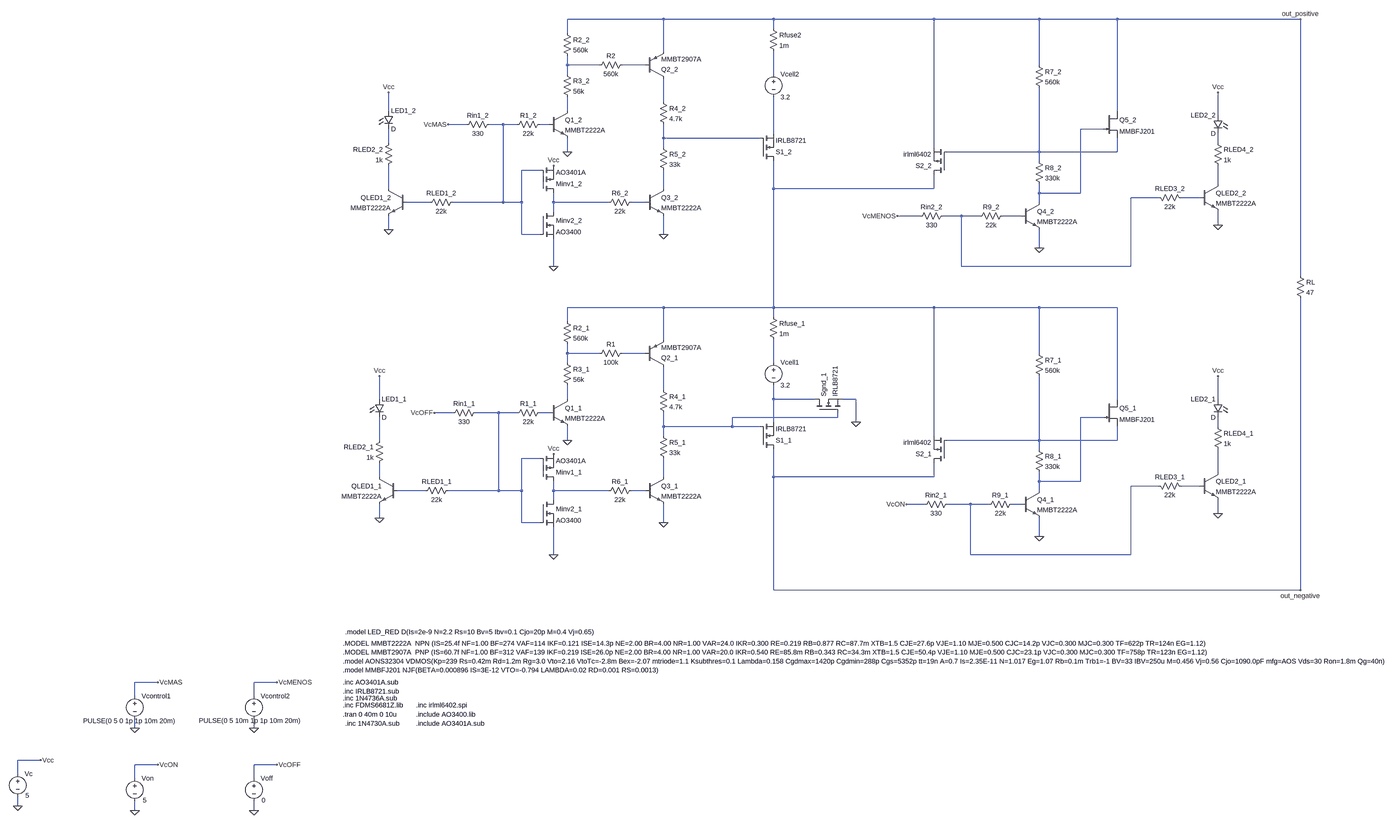
[diagram p0: schematic prueba de resistencias.asc, whole sheet]
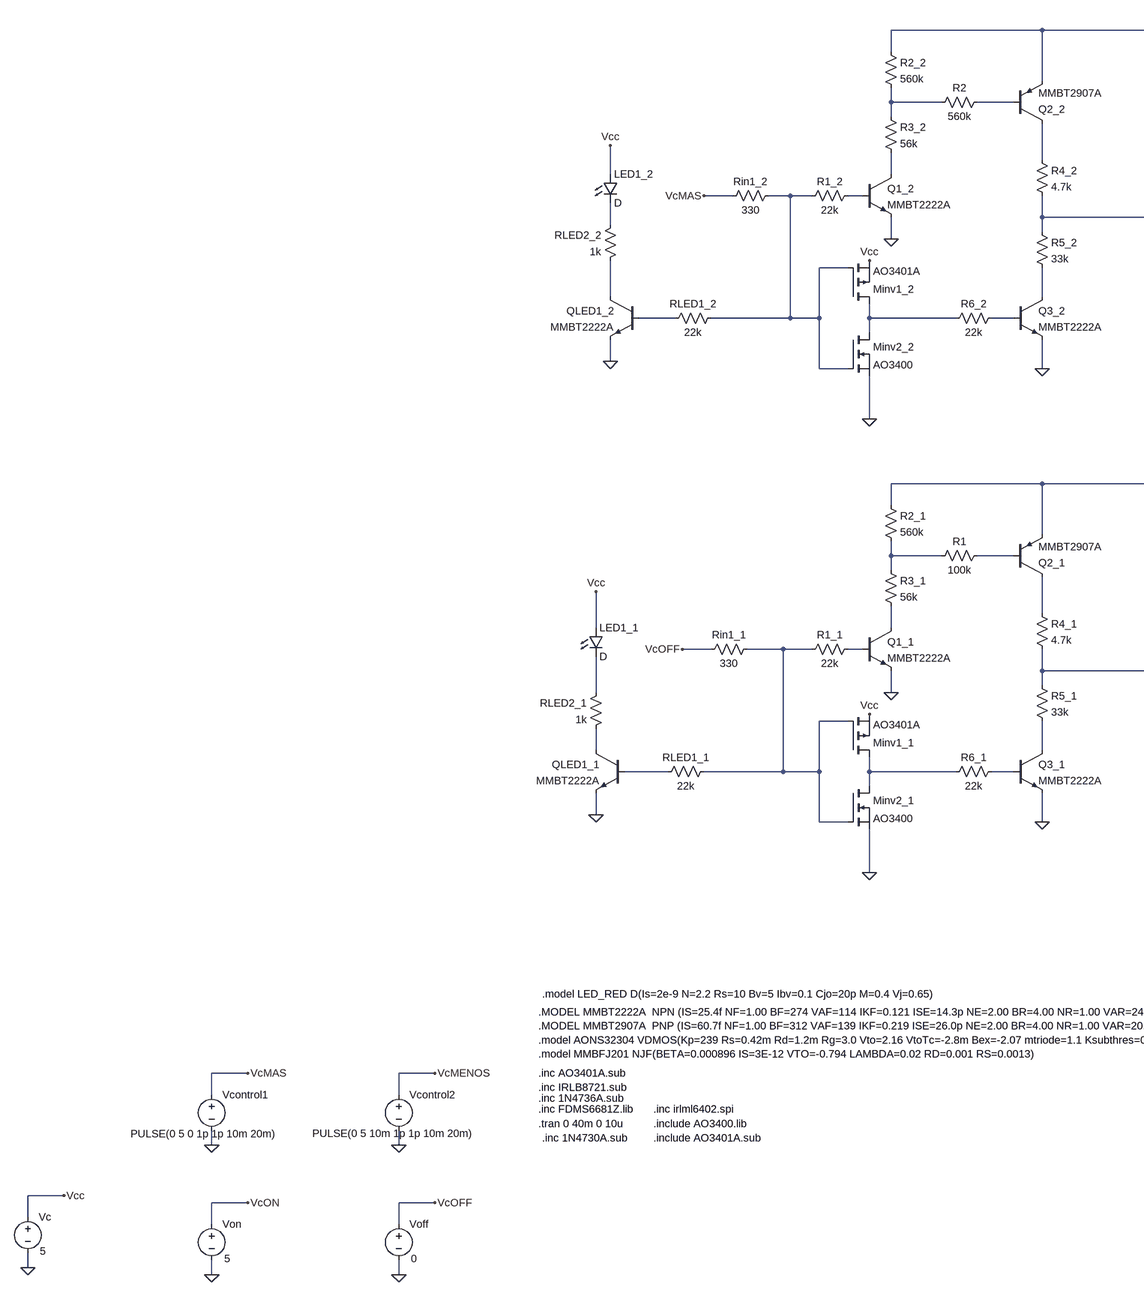
[diagram p1: schematic prueba de resistencias.asc, part, row 1 of 1, column 1 of 2]
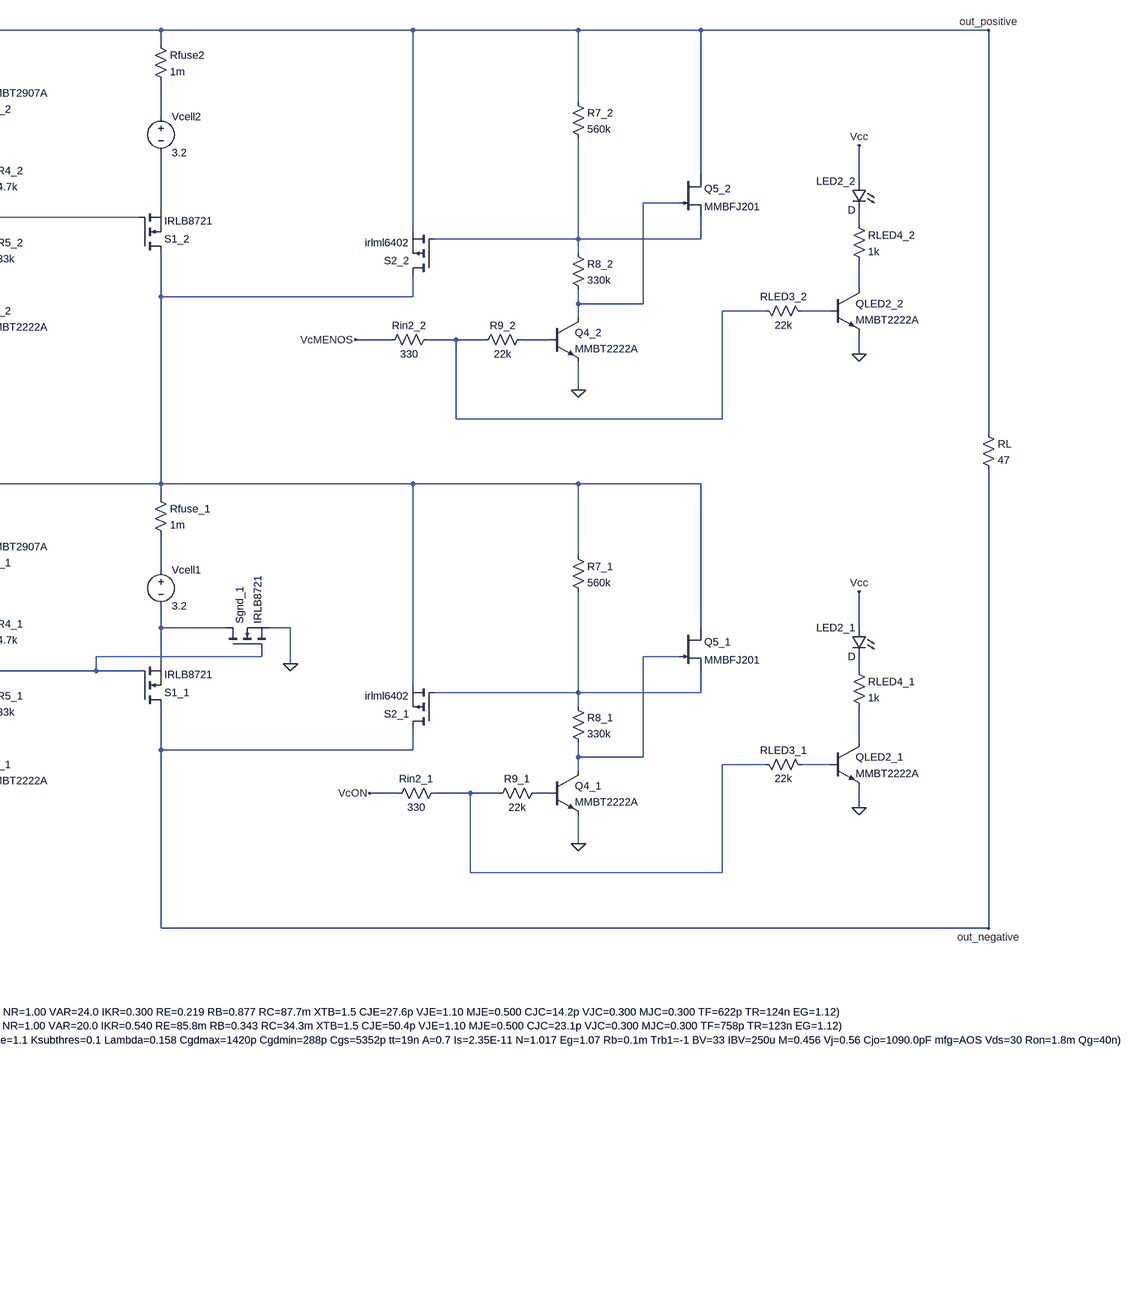
[diagram p2: schematic prueba de resistencias.asc, part, row 1 of 1, column 2 of 2]
prueba de resistencias.asc, the LTspice schematic file:
Version 4.1
SHEET 1 7672 2128
WIRE 896 -1696 560 -1696
WIRE 1280 -1696 896 -1696
WIRE 1840 -1696 1280 -1696
WIRE 2208 -1696 1840 -1696
WIRE 2480 -1696 2208 -1696
WIRE 3120 -1696 2480 -1696
WIRE 1280 -1664 1280 -1696
WIRE 560 -1648 560 -1696
WIRE 896 -1584 896 -1696
WIRE 560 -1536 560 -1568
WIRE 672 -1536 560 -1536
WIRE 832 -1536 752 -1536
WIRE 2208 -1536 2208 -1696
WIRE 560 -1504 560 -1536
WIRE 1280 -1504 1280 -1584
WIRE 896 -1408 896 -1488
WIRE -64 -1376 -64 -1440
WIRE 560 -1376 560 -1424
WIRE 2480 -1376 2480 -1696
WIRE 2832 -1360 2832 -1440
WIRE 208 -1328 144 -1328
WIRE 336 -1328 288 -1328
WIRE 384 -1328 336 -1328
WIRE 496 -1328 464 -1328
WIRE 2432 -1312 2352 -1312
WIRE 1280 -1296 1280 -1424
WIRE 896 -1280 896 -1328
WIRE 1232 -1280 896 -1280
WIRE -64 -1264 -64 -1312
WIRE 2832 -1264 2832 -1296
WIRE 896 -1248 896 -1280
WIRE 1840 -1248 1840 -1696
WIRE 560 -1232 560 -1280
WIRE 2208 -1232 2208 -1456
WIRE 2208 -1232 1888 -1232
WIRE 2480 -1232 2480 -1280
WIRE 2480 -1232 2208 -1232
WIRE 2208 -1200 2208 -1232
WIRE 464 -1168 400 -1168
WIRE 2832 -1120 2832 -1184
WIRE -64 -1104 -64 -1184
WIRE 896 -1104 896 -1168
WIRE 1280 -1104 1280 -1200
WIRE 1840 -1104 1840 -1152
WIRE 1840 -1104 1280 -1104
WIRE 2208 -1088 2208 -1120
WIRE 2352 -1088 2352 -1312
WIRE 2352 -1088 2208 -1088
WIRE 2624 -1072 2528 -1072
WIRE 2768 -1072 2704 -1072
WIRE 80 -1056 0 -1056
WIRE 336 -1056 336 -1328
WIRE 336 -1056 160 -1056
WIRE 400 -1056 400 -1168
WIRE 400 -1056 336 -1056
WIRE 512 -1056 512 -1088
WIRE 704 -1056 512 -1056
WIRE 832 -1056 784 -1056
WIRE 2208 -1056 2208 -1088
WIRE 512 -1024 512 -1056
WIRE 1792 -1008 1712 -1008
WIRE 1936 -1008 1872 -1008
WIRE 2000 -1008 1936 -1008
WIRE 2144 -1008 2080 -1008
WIRE 2832 -976 2832 -1024
WIRE -64 -960 -64 -1008
WIRE 400 -944 400 -1056
WIRE 464 -944 400 -944
WIRE 896 -944 896 -1008
WIRE 2208 -896 2208 -960
WIRE 512 -832 512 -928
WIRE 1936 -832 1936 -1008
WIRE 2528 -832 2528 -1072
WIRE 2528 -832 1936 -832
WIRE 3120 -800 3120 -1696
WIRE 896 -688 560 -688
WIRE 1280 -688 1280 -1104
WIRE 1280 -688 896 -688
WIRE 1840 -688 1280 -688
WIRE 2208 -688 1840 -688
WIRE 2480 -688 2208 -688
WIRE 1280 -656 1280 -688
WIRE 560 -640 560 -688
WIRE 896 -576 896 -688
WIRE 560 -528 560 -560
WIRE 672 -528 560 -528
WIRE 832 -528 752 -528
WIRE 2208 -528 2208 -688
WIRE 560 -496 560 -528
WIRE 1280 -496 1280 -576
WIRE 896 -400 896 -480
WIRE -96 -368 -96 -448
WIRE 560 -368 560 -416
WIRE 1280 -368 1280 -416
WIRE 1424 -368 1280 -368
WIRE 1568 -368 1520 -368
WIRE 2480 -368 2480 -688
WIRE 2832 -368 2832 -448
WIRE 160 -320 96 -320
WIRE 320 -320 240 -320
WIRE 384 -320 320 -320
WIRE 496 -320 464 -320
WIRE 1504 -304 1504 -320
WIRE 1504 -304 1136 -304
WIRE 2432 -304 2352 -304
WIRE 1280 -288 1280 -368
WIRE 1568 -288 1568 -368
WIRE 896 -272 896 -320
WIRE 1136 -272 1136 -304
WIRE 1136 -272 896 -272
WIRE 1232 -272 1136 -272
WIRE 2832 -272 2832 -304
WIRE 896 -240 896 -272
WIRE 1840 -240 1840 -688
WIRE -96 -224 -96 -304
WIRE 560 -224 560 -272
WIRE 2208 -224 2208 -448
WIRE 2208 -224 1888 -224
WIRE 2480 -224 2480 -272
WIRE 2480 -224 2208 -224
WIRE 2208 -192 2208 -224
WIRE 464 -160 400 -160
WIRE 2832 -112 2832 -192
WIRE -96 -96 -96 -144
WIRE 896 -96 896 -160
WIRE 1280 -96 1280 -192
WIRE 1840 -96 1840 -144
WIRE 1840 -96 1280 -96
WIRE 2208 -80 2208 -112
WIRE 2352 -80 2352 -304
WIRE 2352 -80 2208 -80
WIRE 2624 -64 2528 -64
WIRE 2768 -64 2704 -64
WIRE 64 -48 -32 -48
WIRE 320 -48 320 -320
WIRE 320 -48 144 -48
WIRE 400 -48 400 -160
WIRE 400 -48 320 -48
WIRE 512 -48 512 -80
WIRE 704 -48 512 -48
WIRE 832 -48 784 -48
WIRE 2208 -48 2208 -80
WIRE 512 -16 512 -48
WIRE 1808 0 1744 0
WIRE 1968 0 1888 0
WIRE 2032 0 1968 0
WIRE 2144 0 2112 0
WIRE 2832 32 2832 -16
WIRE -96 48 -96 0
WIRE 400 64 400 -48
WIRE 464 64 400 64
WIRE 896 64 896 0
WIRE 2208 112 2208 48
WIRE 512 176 512 80
WIRE 1968 176 1968 0
WIRE 2528 176 2528 -64
WIRE 2528 176 1968 176
WIRE 1280 320 1280 -96
WIRE 3120 320 3120 -720
WIRE 3120 320 1280 320
WIRE -1072 1024 -1152 1024
WIRE -656 1024 -736 1024
WIRE -1152 1072 -1152 1024
WIRE -736 1072 -736 1024
WIRE -1152 1184 -1152 1152
WIRE -736 1184 -736 1152
WIRE -1504 1296 -1584 1296
WIRE -1072 1312 -1152 1312
WIRE -656 1312 -736 1312
WIRE -1584 1344 -1584 1296
WIRE -1152 1360 -1152 1312
WIRE -736 1360 -736 1312
WIRE -1584 1456 -1584 1424
WIRE -1152 1472 -1152 1440
WIRE -736 1472 -736 1440
FLAG 560 -224 0
FLAG 896 64 0
FLAG -1152 1184 0
FLAG -736 1184 0
FLAG -1072 1024 VcMAS
FLAG -656 1024 VcMENOS
FLAG -736 1472 0
FLAG -656 1312 VcOFF
FLAG -1152 1472 0
FLAG -1072 1312 VcON
FLAG 96 -320 VcOFF
FLAG 2208 112 0
FLAG 1744 0 VcON
FLAG -96 48 0
FLAG 2832 32 0
FLAG -96 -448 Vcc
FLAG 2832 -448 Vcc
FLAG -1584 1456 0
FLAG -1504 1296 Vcc
FLAG 512 176 0
FLAG 512 -176 Vcc
FLAG 1568 -288 0
FLAG 560 -1232 0
FLAG 896 -944 0
FLAG 144 -1328 VcMAS
FLAG 2208 -896 0
FLAG 1712 -1008 VcMENOS
FLAG -64 -960 0
FLAG 2832 -976 0
FLAG -64 -1440 Vcc
FLAG 2832 -1440 Vcc
FLAG 512 -832 0
FLAG 512 -1184 Vcc
FLAG 3120 -1696 out_positive
FLAG 3120 320 out_negative
SYMBOL npn 832 -96 R0
SYMATTR InstName Q3_1
SYMATTR Value MMBT2222A
SYMBOL res 880 -256 R0
SYMATTR InstName R5_1
SYMATTR Value 33k
SYMBOL res 880 -416 R0
SYMATTR InstName R4_1
SYMATTR Value 4.7k
SYMBOL npn 496 -368 R0
SYMATTR InstName Q1_1
SYMATTR Value MMBT2222A
SYMBOL res 544 -512 R0
SYMATTR InstName R3_1
SYMATTR Value 56k
SYMBOL res 544 -656 R0
SYMATTR InstName R2_1
SYMATTR Value 560k
SYMBOL res 800 -64 R90
WINDOW 0 0 56 VBottom 2
WINDOW 3 32 56 VTop 2
SYMATTR InstName R6_1
SYMATTR Value 22k
SYMBOL voltage 1280 -512 R0
WINDOW 123 0 0 Left 0
WINDOW 39 0 0 Left 0
SYMATTR InstName Vcell1
SYMATTR Value 3.2
SYMBOL pnp 832 -480 M180
SYMATTR InstName Q2_1
SYMATTR Value MMBT2907A
SYMBOL nmos 1232 -192 M180
SYMATTR InstName S1_1
SYMATTR Value IRLB8721
SYMATTR Prefix X
SYMBOL voltage -1152 1056 R0
WINDOW 3 -180 103 Left 2
WINDOW 123 0 0 Left 0
WINDOW 39 0 0 Left 0
SYMATTR Value PULSE(0 5 0 1p 1p 10m 20m)
SYMATTR InstName Vcontrol1
SYMBOL voltage -736 1056 R0
WINDOW 3 -192 102 Left 2
WINDOW 123 0 0 Left 0
WINDOW 39 0 0 Left 0
SYMATTR Value PULSE(0 5 10m 1p 1p 10m 20m)
SYMATTR InstName Vcontrol2
SYMBOL voltage -736 1344 R0
WINDOW 3 27 92 Left 2
WINDOW 123 0 0 Left 0
WINDOW 39 0 0 Left 0
SYMATTR Value 0
SYMATTR InstName Voff
SYMBOL voltage -1152 1344 R0
WINDOW 3 28 92 Left 2
WINDOW 123 0 0 Left 0
WINDOW 39 0 0 Left 0
SYMATTR Value 5
SYMATTR InstName Von
SYMBOL res 480 -336 R90
WINDOW 0 0 56 VBottom 2
WINDOW 3 32 56 VTop 2
SYMATTR InstName R1_1
SYMATTR Value 22k
SYMBOL res 1264 -672 R0
SYMATTR InstName Rfuse_1
SYMATTR Value 1m
SYMBOL npn 2144 -48 R0
SYMATTR InstName Q4_1
SYMATTR Value MMBT2222A
SYMBOL res 2128 -16 R90
WINDOW 0 0 56 VBottom 2
WINDOW 3 32 56 VTop 2
SYMATTR InstName R9_1
SYMATTR Value 22k
SYMBOL res 2192 -544 R0
SYMATTR InstName R7_1
SYMATTR Value 560k
SYMBOL pmos 1888 -144 R180
SYMATTR InstName S2_1
SYMATTR Value irlml6402
SYMATTR Prefix X
SYMBOL npn -32 -96 M0
SYMATTR InstName QLED1_1
SYMATTR Value MMBT2222A
SYMBOL res -80 -240 M0
SYMATTR InstName RLED2_1
SYMATTR Value 1k
SYMBOL res 160 -64 R90
WINDOW 0 0 56 VBottom 2
WINDOW 3 32 56 VTop 2
SYMATTR InstName RLED1_1
SYMATTR Value 22k
SYMBOL LED -112 -368 R0
SYMATTR InstName LED1_1
SYMBOL npn 2768 -112 R0
SYMATTR InstName QLED2_1
SYMATTR Value MMBT2222A
SYMBOL res 2816 -288 R0
SYMATTR InstName RLED4_1
SYMATTR Value 1k
SYMBOL res 2608 -80 M90
WINDOW 0 0 56 VBottom 2
WINDOW 3 32 56 VTop 2
SYMATTR InstName RLED3_1
SYMATTR Value 22k
SYMBOL LED 2848 -368 M0
SYMATTR InstName LED2_1
SYMBOL res 2192 -208 R0
SYMATTR InstName R8_1
SYMATTR Value 330k
SYMBOL res 3104 -816 R0
SYMATTR InstName RL
SYMATTR Value 47
SYMBOL voltage -1584 1328 R0
WINDOW 3 27 92 Left 2
WINDOW 123 0 0 Left 0
WINDOW 39 0 0 Left 0
SYMATTR Value 5
SYMATTR InstName Vc
SYMBOL pmos 464 -80 M180
SYMATTR InstName Minv1_1
SYMATTR Value AO3401A
SYMATTR Prefix X
SYMBOL nmos 464 -16 R0
SYMATTR InstName Minv2_1
SYMATTR Value AO3400
SYMATTR Prefix X
SYMBOL njf 2432 -368 R0
SYMATTR InstName Q5_1
SYMATTR Value MMBFJ201
SYMBOL nmos 1424 -320 R270
SYMATTR InstName Sgnd_1
SYMATTR Value IRLB8721
SYMATTR Prefix X
SYMBOL npn 832 -1104 R0
SYMATTR InstName Q3_2
SYMATTR Value MMBT2222A
SYMBOL res 880 -1264 R0
SYMATTR InstName R5_2
SYMATTR Value 33k
SYMBOL res 880 -1424 R0
SYMATTR InstName R4_2
SYMATTR Value 4.7k
SYMBOL npn 496 -1376 R0
SYMATTR InstName Q1_2
SYMATTR Value MMBT2222A
SYMBOL res 544 -1520 R0
SYMATTR InstName R3_2
SYMATTR Value 56k
SYMBOL res 544 -1664 R0
SYMATTR InstName R2_2
SYMATTR Value 560k
SYMBOL res 800 -1072 R90
WINDOW 0 0 56 VBottom 2
WINDOW 3 32 56 VTop 2
SYMATTR InstName R6_2
SYMATTR Value 22k
SYMBOL voltage 1280 -1520 R0
WINDOW 123 0 0 Left 0
WINDOW 39 0 0 Left 0
SYMATTR InstName Vcell2
SYMATTR Value 3.2
SYMBOL pnp 832 -1488 M180
SYMATTR InstName Q2_2
SYMATTR Value MMBT2907A
SYMBOL nmos 1232 -1200 M180
SYMATTR InstName S1_2
SYMATTR Value IRLB8721
SYMATTR Prefix X
SYMBOL res 480 -1344 R90
WINDOW 0 0 56 VBottom 2
WINDOW 3 32 56 VTop 2
SYMATTR InstName R1_2
SYMATTR Value 22k
SYMBOL res 1264 -1680 R0
SYMATTR InstName Rfuse2
SYMATTR Value 1m
SYMBOL npn 2144 -1056 R0
SYMATTR InstName Q4_2
SYMATTR Value MMBT2222A
SYMBOL res 2096 -1024 R90
WINDOW 0 0 56 VBottom 2
WINDOW 3 32 56 VTop 2
SYMATTR InstName R9_2
SYMATTR Value 22k
SYMBOL res 2192 -1552 R0
SYMATTR InstName R7_2
SYMATTR Value 560k
SYMBOL pmos 1888 -1152 R180
SYMATTR InstName S2_2
SYMATTR Value irlml6402
SYMATTR Prefix X
SYMBOL npn 0 -1104 M0
SYMATTR InstName QLED1_2
SYMATTR Value MMBT2222A
SYMBOL res -48 -1280 M0
SYMATTR InstName RLED2_2
SYMATTR Value 1k
SYMBOL res 176 -1072 R90
WINDOW 0 0 56 VBottom 2
WINDOW 3 32 56 VTop 2
SYMATTR InstName RLED1_2
SYMATTR Value 22k
SYMBOL LED -80 -1376 R0
SYMATTR InstName LED1_2
SYMBOL npn 2768 -1120 R0
SYMATTR InstName QLED2_2
SYMATTR Value MMBT2222A
SYMBOL res 2816 -1280 R0
SYMATTR InstName RLED4_2
SYMATTR Value 1k
SYMBOL res 2608 -1088 M90
WINDOW 0 0 56 VBottom 2
WINDOW 3 32 56 VTop 2
SYMATTR InstName RLED3_2
SYMATTR Value 22k
SYMBOL LED 2848 -1360 M0
SYMATTR InstName LED2_2
SYMBOL res 2192 -1216 R0
SYMATTR InstName R8_2
SYMATTR Value 330k
SYMBOL pmos 464 -1088 M180
SYMATTR InstName Minv1_2
SYMATTR Value AO3401A
SYMATTR Prefix X
SYMBOL nmos 464 -1024 R0
SYMATTR InstName Minv2_2
SYMATTR Value AO3400
SYMATTR Prefix X
SYMBOL njf 2432 -1376 R0
SYMATTR InstName Q5_2
SYMATTR Value MMBFJ201
SYMBOL res 256 -336 R90
WINDOW 0 0 56 VBottom 2
WINDOW 3 32 56 VTop 2
SYMATTR InstName Rin1_1
SYMATTR Value 330
SYMBOL res 304 -1344 R90
WINDOW 0 0 56 VBottom 2
WINDOW 3 32 56 VTop 2
SYMATTR InstName Rin1_2
SYMATTR Value 330
SYMBOL res 1904 -16 R90
WINDOW 0 0 56 VBottom 2
WINDOW 3 32 56 VTop 2
SYMATTR InstName Rin2_1
SYMATTR Value 330
SYMBOL res 1888 -1024 R90
WINDOW 0 0 56 VBottom 2
WINDOW 3 32 56 VTop 2
SYMATTR InstName Rin2_2
SYMATTR Value 330
SYMBOL res 768 -1552 R90
WINDOW 0 0 56 VBottom 2
WINDOW 3 32 56 VTop 2
SYMATTR InstName R2
SYMATTR Value 560k
SYMBOL res 768 -544 R90
WINDOW 0 0 56 VBottom 2
WINDOW 3 32 56 VTop 2
SYMATTR InstName R1
SYMATTR Value 100k
TEXT -224 1136 Left 2 !.tran 0 40m 0 10u
TEXT -224 888 Left 2 !.MODEL MMBT2222A  NPN (IS=25.4f NF=1.00 BF=274 VAF=114 IKF=0.121 ISE=14.3p NE=2.00 BR=4.00 NR=1.00 VAR=24.0 IKR=0.300 RE=0.219 RB=0.877 RC=87.7m XTB=1.5 CJE=27.6p VJE=1.10 MJE=0.500 CJC=14.2p VJC=0.300 MJC=0.300 TF=622p TR=124n EG=1.12)\n.MODEL MMBT2907A  PNP (IS=60.7f NF=1.00 BF=312 VAF=139 IKF=0.219 ISE=26.0p NE=2.00 BR=4.00 NR=1.00 VAR=20.0 IKR=0.540 RE=85.8m RB=0.343 RC=34.3m XTB=1.5 CJE=50.4p VJE=1.10 MJE=0.500 CJC=23.1p VJC=0.300 MJC=0.300 TF=758p TR=123n EG=1.12)\n.model AONS32304 VDMOS(Kp=239 Rs=0.42m Rd=1.2m Rg=3.0 Vto=2.16 VtoTc=-2.8m Bex=-2.07 mtriode=1.1 Ksubthres=0.1 Lambda=0.158 Cgdmax=1420p Cgdmin=288p Cgs=5352p tt=19n A=0.7 Is=2.35E-11 N=1.017 Eg=1.07 Rb=0.1m Trb1=-1 BV=33 IBV=250u M=0.456 Vj=0.56 Cjo=1090.0pF mfg=AOS Vds=30 Ron=1.8m Qg=40n)\n.model MMBFJ201 NJF(BETA=0.000896 IS=3E-12 VTO=-0.794 LAMBDA=0.02 RD=0.001 RS=0.0013)
TEXT -224 1024 Left 2 !.inc AO3401A.sub\n.inc IRLB8721.sub
TEXT -224 1080 Left 2 !.inc 1N4736A.sub
TEXT -224 1104 Left 2 !.inc FDMS6681Z.lib
TEXT -216 1168 Left 2 !.inc 1N4730A.sub
TEXT -216 848 Left 2 !.model LED_RED D(Is=2e-9 N=2.2 Rs=10 Bv=5 Ibv=0.1 Cjo=20p M=0.4 Vj=0.65)
TEXT 32 1104 Left 2 !.inc irlml6402.spi
TEXT 32 1136 Left 2 !.include AO3400.lib
TEXT 32 1168 Left 2 !.include AO3401A.sub

The netlist it stands for:
* prueba de resistencias.asc
Q3_1 N039 N044 0 0 MMBT2222A
R5_1 N032 N039 33k
R4_1 N027 N032 4.7k
Q1_1 N028 N031 0 0 MMBT2222A
R3_1 N024 N028 56k
R2_1 N017 N024 560k
R6_1 N044 N043 22k
Vcell1 N026 N029 3.2
Q2_1 N027 N025 N017 0 MMBT2907A
X§S1_1 out_negative N032 N029 IRLB8721  ; pins D G S
Vcontrol1 VcMAS 0 PULSE(0 5 0 1p 1p 10m 20m)
Vcontrol2 VcMENOS 0 PULSE(0 5 10m 1p 1p 10m 20m)
Voff VcOFF 0 0
Von VcON 0 5
R1_1 N031 N030 22k
Rfuse_1 N017 N026 1m
Q4_1 N033 N045 0 0 MMBT2222A
R9_1 N045 N040 22k
R7_1 N017 N036 560k
X§S2_1 out_negative N036 N017 irlml6402  ; pins D G S
QLED1_1 N038 N042 0 0 MMBT2222A
RLED2_1 N035 N038 1k
RLED1_1 N030 N042 22k
D§LED1_1 Vcc N035 D
QLED2_1 N037 N041 0 0 MMBT2222A
RLED4_1 N034 N037 1k
RLED3_1 N040 N041 22k
D§LED2_1 Vcc N034 D
R8_1 N036 N033 330k
RL out_positive out_negative 47
Vc Vcc 0 5
X§Minv1_1 N043 N030 Vcc AO3401A  ; pins D G S
X§Minv2_1 N043 N030 0 AO3400  ; pins D G S
J§Q5_1 N017 N033 N036 MMBFJ201
X§Sgnd_1 N029 N032 0 IRLB8721  ; pins D G S
Q3_2 N016 N022 0 0 MMBT2222A
R5_2 N010 N016 33k
R4_2 N004 N010 4.7k
Q1_2 N005 N007 0 0 MMBT2222A
R3_2 N001 N005 56k
R2_2 out_positive N001 560k
R6_2 N022 N021 22k
Vcell2 N003 N009 3.2
Q2_2 N004 N002 out_positive 0 MMBT2907A
X§S1_2 N017 N010 N009 IRLB8721  ; pins D G S
R1_2 N007 N006 22k
Rfuse2 out_positive N003 1m
Q4_2 N008 N023 0 0 MMBT2222A
R9_2 N023 N018 22k
R7_2 out_positive N013 560k
X§S2_2 N017 N013 out_positive irlml6402  ; pins D G S
QLED1_2 N015 N020 0 0 MMBT2222A
RLED2_2 N011 N015 1k
RLED1_2 N006 N020 22k
D§LED1_2 Vcc N011 D
QLED2_2 N014 N019 0 0 MMBT2222A
RLED4_2 N012 N014 1k
RLED3_2 N018 N019 22k
D§LED2_2 Vcc N012 D
R8_2 N013 N008 330k
X§Minv1_2 N021 N006 Vcc AO3401A  ; pins D G S
X§Minv2_2 N021 N006 0 AO3400  ; pins D G S
J§Q5_2 out_positive N008 N013 MMBFJ201
Rin1_1 N030 VcOFF 330
Rin1_2 N006 VcMAS 330
Rin2_1 N040 VcON 330
Rin2_2 N018 VcMENOS 330
R2 N002 N001 560k
R1 N025 N024 100k
.model D D
.lib standard.dio
.model NPN NPN
.model PNP PNP
.lib standard.bjt
.model NJF NJF
.model PJF PJF
.lib standard.jft
.tran 0 40m 0 10u
.MODEL MMBT2222A  NPN (IS=25.4f NF=1.00 BF=274 VAF=114 IKF=0.121 ISE=14.3p NE=2.00 BR=4.00 NR=1.00 VAR=24.0 IKR=0.300 RE=0.219 RB=0.877 RC=87.7m XTB=1.5 CJE=27.6p VJE=1.10 MJE=0.500 CJC=14.2p VJC=0.300 MJC=0.300 TF=622p TR=124n EG=1.12)
.MODEL MMBT2907A  PNP (IS=60.7f NF=1.00 BF=312 VAF=139 IKF=0.219 ISE=26.0p NE=2.00 BR=4.00 NR=1.00 VAR=20.0 IKR=0.540 RE=85.8m RB=0.343 RC=34.3m XTB=1.5 CJE=50.4p VJE=1.10 MJE=0.500 CJC=23.1p VJC=0.300 MJC=0.300 TF=758p TR=123n EG=1.12)
.model AONS32304 VDMOS(Kp=239 Rs=0.42m Rd=1.2m Rg=3.0 Vto=2.16 VtoTc=-2.8m Bex=-2.07 mtriode=1.1 Ksubthres=0.1 Lambda=0.158 Cgdmax=1420p Cgdmin=288p Cgs=5352p tt=19n A=0.7 Is=2.35E-11 N=1.017 Eg=1.07 Rb=0.1m Trb1=-1 BV=33 IBV=250u M=0.456 Vj=0.56 Cjo=1090.0pF mfg=AOS Vds=30 Ron=1.8m Qg=40n)
.model MMBFJ201 NJF(BETA=0.000896 IS=3E-12 VTO=-0.794 LAMBDA=0.02 RD=0.001 RS=0.0013)
.inc AO3401A.sub
.inc IRLB8721.sub
.inc 1N4736A.sub
.inc FDMS6681Z.lib
.inc 1N4730A.sub
.model LED_RED D(Is=2e-9 N=2.2 Rs=10 Bv=5 Ibv=0.1 Cjo=20p M=0.4 Vj=0.65)
.inc irlml6402.spi
.include AO3400.lib
.include AO3401A.sub
.backanno
.end